# Altium schematic sheet Ej6_Esquematico.SchDoc
size A4
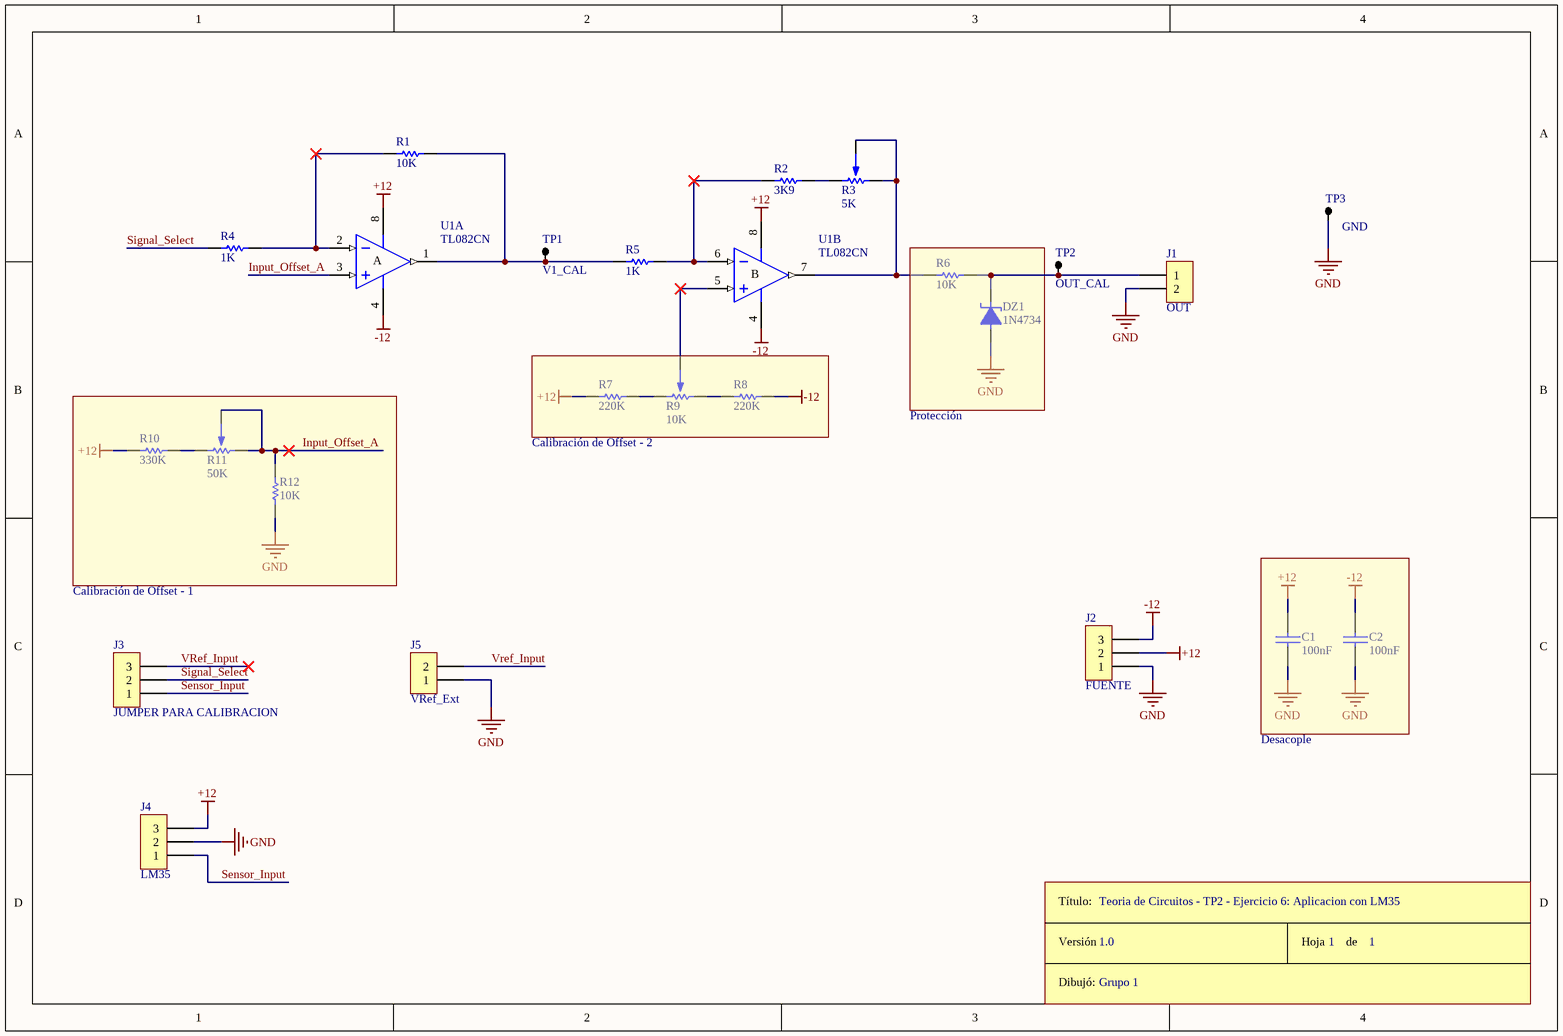
[diagram p0: Ej6_Esquematico.SchDoc]

## Parts
C1  100nF  [CAP100]
C2  100nF  [CAP100]
DZ1  1N4734  [DO41]
J1  OUT  [SIP2]
J2  FUENTE  [BORNERA3]
J3  JUMPER PARA CALIBRACION  [SIP3]
J4  LM35  [SIP3]
J5  VRef_Ext  [SIP2]
R1  10K  [RES300]
R2  3K9  [RES300]
R3  5K  [PRESET V]
R4  1K  [RES300]
R5  1K  [RES300]
R6  10K  [RES300]
R7  220K  [RES300]
R8  220K  [RES300]
R9  10K  [PRESET V]
R10  330K  [RES300]
R11  50K  [PRESET V]
R12  10K  [RES300]
ROT1  Rótulo  (value not drawn)
TP1  V1_CAL  [TPTH]
TP2  OUT_CAL  [TPTH]
TP3  GND  [TPTH]
U1  TL082CN  [DIP8]  (parts A,B of 2)

## Nets
+12: C1.1 J2.2 J4.3 R7.2 R10.1 U1.8(V+)
-12: C2.1 J2.3 R8.1 U1.4(V-)
GND: C1.2 C2.2 DZ1.1 J1.2 J2.1 J4.2 J5.1 R12.1 TP3.1
Input_Offset_A: R11.2 R11.3 R12.2 U1.3(IN+)
Sensor_Input: J3.1 J4.1
Signal_Select: J3.2 R4.1
VRef_Input: J3.3 J5.2
NetDZ1_2: DZ1.2 J1.1 R6.2 TP2.1
NetR1_1: R1.1 R4.2 U1.2(IN-)
NetR1_2: R1.2 R5.1 TP1.1 U1.1(OUT)
NetR2_1: R2.1 R5.2 U1.6(IN-)
NetR2_2: R2.2 R3.1
NetR3_2: R3.2 R3.3 R6.1 U1.7(OUT)
NetR7_1: R7.1 R9.1
NetR8_2: R8.2 R9.3
NetR9_2: R9.2 U1.5(IN+)
NetR10_2: R10.2 R11.1

## Notes on the sheet
- Calibración de Offset - 2
- Protección
- Calibración de Offset - 1
- Desacople
- Teoria de Circuitos - TP2 - Ejercicio 6: Aplicacion con LM35
- Grupo 1
- 1.0
- 1
- (in symbol Rótulo) Título:; Versión; Hoja       de; Dibujó:
- (in symbol TL082CN, part A) A
- (in symbol TL082CN, part B) B

## Library data of the parts
C1 C2 = CAP
DZ1 = DIODO ZENER
J1 J5 = CON2
J2 = BORNERA 3
J3 J4 = CON3
R1 R2 R4-R8 R10 R12 = RES
R3 R9 R11 = PRESET
TP1-TP3 = TP
U1 = TL082CN: General-Purpose J-FET Dual Operational Amplifier; Published: 24-Aug-2001; LatestRevisionDate: 06-Jun-2005; LatestRevisionNote: Stylized 3D Model Added.; DatasheetVersion: Jan-1999; PackageReference: DIP8; Publisher: Altium Limited; PackageDescription: DIP; 8 Leads; Row Spacing 7.62 mm; Pitch 2.54 mm; Code_JEDEC: MO-001-AN; ComponentLink1Description: Manufacturer Link; ComponentLink1URL: http://www.st.com/; ComponentLink2Description: Datasheet; ComponentLink2URL: http://www.st.com/stonline/products/literature/ds/2300/tl082.pdf